# Altium schematic sheet RGB and TurnS.SchDoc
size B
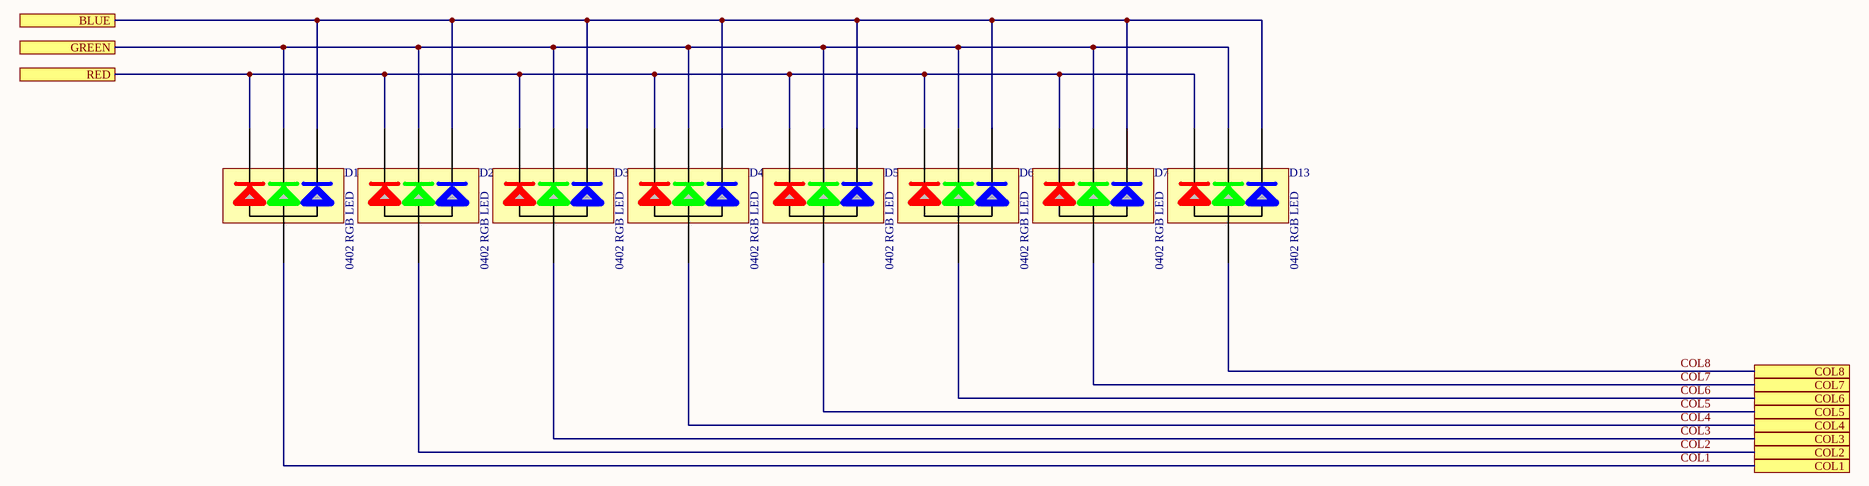
[diagram p0: RGB and TurnS.SchDoc]

## Parts
D1  0402 RGB LED  [0404 RGB LED]
D2  0402 RGB LED  [0404 RGB LED]
D3  0402 RGB LED  [0404 RGB LED]
D4  0402 RGB LED  [0404 RGB LED]
D5  0402 RGB LED  [0404 RGB LED]
D6  0402 RGB LED  [0404 RGB LED]
D7  0402 RGB LED  [0404 RGB LED]
D13  0402 RGB LED  [0404 RGB LED]

## Ports
BLUE, COL1, COL2, COL3, COL4, COL5, COL6, COL7, COL8, GREEN, RED

## Nets
BLUE: D1.4 D2.4 D3.4 D4.4 D5.4 D6.4 D7.4 D13.4 ; port BLUE
COL1: D1.1 ; port COL1
COL2: D2.1 ; port COL2
COL3: D3.1 ; port COL3
COL4: D4.1 ; port COL4
COL5: D5.1 ; port COL5
COL6: D6.1 ; port COL6
COL7: D7.1 ; port COL7
COL8: D13.1 ; port COL8
GREEN: D1.3 D2.3 D3.3 D4.3 D5.3 D6.3 D7.3 D13.3 ; port GREEN
RED: D1.2 D2.2 D3.2 D4.2 D5.2 D6.2 D7.2 D13.2 ; port RED

## Notes on the sheet
- Title
- Size:
- Date:
- Letter
- Number:
- Time:
- Revision:
- Sheet
- of
- Copyright 2019
- Specialized Solutions LLC
- 206 W Lincoln Hwy STE B
- New Haven, IN 46774
- www.specsolns.com <http://www.specsolns.com>
- File: